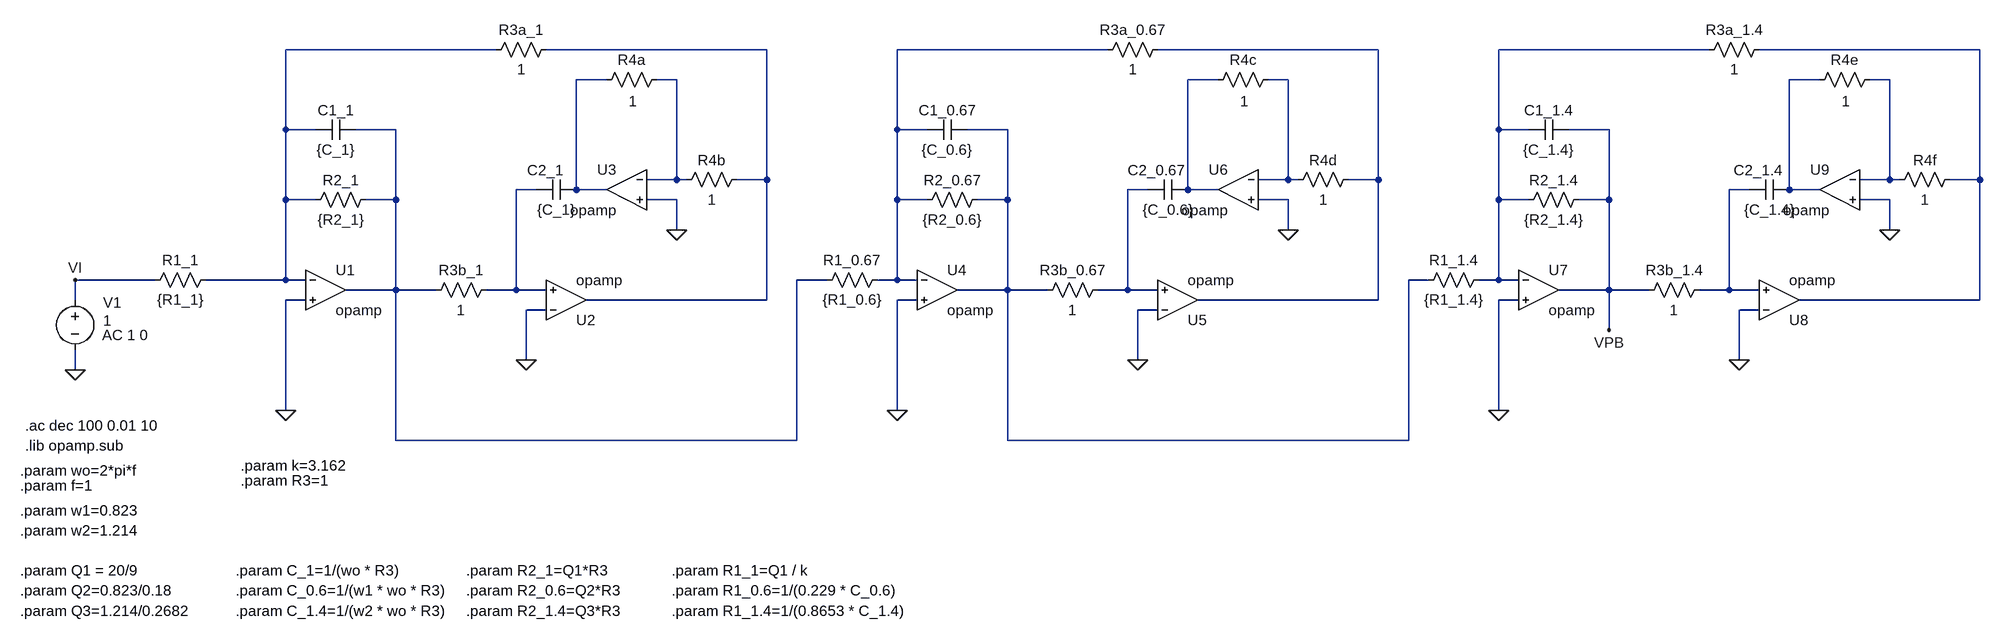
[diagram p0: schematic TransformacionLP2BP.asc]
TransformacionLP2BP.asc, the LTspice schematic file:
Version 4
SHEET 1 2392 1280
WIRE 16 -96 -320 -96
WIRE 448 -96 96 -96
WIRE 992 -96 656 -96
WIRE 1424 -96 1072 -96
WIRE 1952 -96 1616 -96
WIRE 2384 -96 2032 -96
WIRE 192 -48 144 -48
WIRE 304 -48 272 -48
WIRE 1168 -48 1120 -48
WIRE 1280 -48 1248 -48
WIRE 2128 -48 2080 -48
WIRE 2240 -48 2208 -48
WIRE -320 32 -320 -96
WIRE -272 32 -320 32
WIRE -144 32 -208 32
WIRE 656 32 656 -96
WIRE 704 32 656 32
WIRE 832 32 768 32
WIRE 1616 32 1616 -96
WIRE 1664 32 1616 32
WIRE 1792 32 1728 32
WIRE 304 112 304 -48
WIRE 304 112 256 112
WIRE 320 112 304 112
WIRE 448 112 448 -96
WIRE 448 112 400 112
WIRE 1280 112 1280 -48
WIRE 1280 112 1232 112
WIRE 1296 112 1280 112
WIRE 1424 112 1424 -96
WIRE 1424 112 1376 112
WIRE 2240 112 2240 -48
WIRE 2240 112 2192 112
WIRE 2256 112 2240 112
WIRE 2384 112 2384 -96
WIRE 2384 112 2336 112
WIRE 80 128 48 128
WIRE 144 128 144 -48
WIRE 192 128 144 128
WIRE 1056 128 1024 128
WIRE 1120 128 1120 -48
WIRE 1168 128 1120 128
WIRE 2016 128 1984 128
WIRE 2080 128 2080 -48
WIRE 2128 128 2080 128
WIRE -320 144 -320 32
WIRE -272 144 -320 144
WIRE -144 144 -144 32
WIRE -144 144 -192 144
WIRE 304 144 256 144
WIRE 656 144 656 32
WIRE 704 144 656 144
WIRE 832 144 832 32
WIRE 832 144 784 144
WIRE 1280 144 1232 144
WIRE 1616 144 1616 32
WIRE 1664 144 1616 144
WIRE 1792 144 1792 32
WIRE 1792 144 1744 144
WIRE 2240 144 2192 144
WIRE 304 192 304 144
WIRE 1280 192 1280 144
WIRE 2240 192 2240 144
WIRE -528 272 -656 272
WIRE -320 272 -320 144
WIRE -320 272 -448 272
WIRE -288 272 -320 272
WIRE 544 272 496 272
WIRE 656 272 656 144
WIRE 656 272 624 272
WIRE 688 272 656 272
WIRE 1504 272 1472 272
WIRE 1616 272 1616 144
WIRE 1616 272 1584 272
WIRE 1648 272 1616 272
WIRE -144 288 -144 144
WIRE -144 288 -224 288
WIRE -80 288 -144 288
WIRE 48 288 48 128
WIRE 48 288 0 288
WIRE 96 288 48 288
WIRE 832 288 832 144
WIRE 832 288 752 288
WIRE 896 288 832 288
WIRE 1024 288 1024 128
WIRE 1024 288 976 288
WIRE 1072 288 1024 288
WIRE 1792 288 1792 144
WIRE 1792 288 1712 288
WIRE 1856 288 1792 288
WIRE 1984 288 1984 128
WIRE 1984 288 1936 288
WIRE 2032 288 1984 288
WIRE -656 304 -656 272
WIRE -288 304 -320 304
WIRE 448 304 448 112
WIRE 448 304 160 304
WIRE 688 304 656 304
WIRE 1424 304 1424 112
WIRE 1424 304 1136 304
WIRE 1648 304 1616 304
WIRE 2384 304 2384 112
WIRE 2384 304 2096 304
WIRE 96 320 64 320
WIRE 1072 320 1040 320
WIRE 2032 320 2000 320
WIRE 1792 352 1792 288
WIRE 64 400 64 320
WIRE 1040 400 1040 320
WIRE 2000 400 2000 320
WIRE -656 416 -656 384
WIRE -320 480 -320 304
WIRE 656 480 656 304
WIRE 1616 480 1616 304
WIRE -144 528 -144 288
WIRE 496 528 496 272
WIRE 496 528 -144 528
WIRE 832 528 832 288
WIRE 1472 528 1472 272
WIRE 1472 528 832 528
FLAG -320 480 0
FLAG -656 416 0
FLAG 64 400 0
FLAG -656 272 VI
FLAG 304 192 0
FLAG 656 480 0
FLAG 1040 400 0
FLAG 1280 192 0
FLAG 1616 480 0
FLAG 2000 400 0
FLAG 2240 192 0
FLAG 1792 352 VPB
SYMBOL res -432 256 R90
WINDOW 0 0 56 VBottom 2
WINDOW 3 32 56 VTop 2
SYMATTR InstName R1_1
SYMATTR Value {R1_1}
SYMBOL res -176 128 R90
WINDOW 0 0 56 VBottom 2
WINDOW 3 32 56 VTop 2
SYMATTR InstName R2_1
SYMATTR Value {R2_1}
SYMBOL cap -208 16 R90
WINDOW 0 0 32 VBottom 2
WINDOW 3 32 32 VTop 2
SYMATTR InstName C1_1
SYMATTR Value {C_1}
SYMBOL voltage -656 288 R0
WINDOW 3 45 49 Left 2
WINDOW 123 43 72 Left 2
WINDOW 39 0 0 Left 0
WINDOW 0 45 20 Left 2
SYMATTR Value 1
SYMATTR Value2 AC 1 0
SYMATTR InstName V1
SYMBOL res 16 272 R90
WINDOW 0 0 56 VBottom 2
WINDOW 3 32 56 VTop 2
SYMATTR InstName R3b_1
SYMATTR Value 1
SYMBOL res 112 -112 R90
WINDOW 0 0 56 VBottom 2
WINDOW 3 32 56 VTop 2
SYMATTR InstName R3a_1
SYMATTR Value 1
SYMBOL cap 144 112 R90
WINDOW 0 0 50 VBottom 2
WINDOW 3 32 32 VTop 2
SYMATTR InstName C2_1
SYMATTR Value {C_1}
SYMBOL res 288 -64 R90
WINDOW 0 0 56 VBottom 2
WINDOW 3 35 54 VTop 2
SYMATTR InstName R4a
SYMATTR Value 1
SYMBOL res 416 96 R90
WINDOW 0 0 56 VBottom 2
WINDOW 3 32 56 VTop 2
SYMATTR InstName R4b
SYMATTR Value 1
SYMBOL OpAmps\\opamp -256 224 R0
SYMATTR InstName U1
SYMBOL OpAmps\\opamp 128 368 M180
SYMATTR InstName U2
SYMBOL OpAmps\\opamp 224 64 M0
SYMATTR InstName U3
SYMBOL res 800 128 R90
WINDOW 0 0 56 VBottom 2
WINDOW 3 32 56 VTop 2
SYMATTR InstName R2_0.67
SYMATTR Value {R2_0.6}
SYMBOL cap 768 16 R90
WINDOW 0 0 32 VBottom 2
WINDOW 3 32 32 VTop 2
SYMATTR InstName C1_0.67
SYMATTR Value {C_0.6}
SYMBOL res 992 272 R90
WINDOW 0 0 56 VBottom 2
WINDOW 3 32 56 VTop 2
SYMATTR InstName R3b_0.67
SYMATTR Value 1
SYMBOL res 1088 -112 R90
WINDOW 0 0 56 VBottom 2
WINDOW 3 32 56 VTop 2
SYMATTR InstName R3a_0.67
SYMATTR Value 1
SYMBOL cap 1120 112 R90
WINDOW 0 0 50 VBottom 2
WINDOW 3 32 32 VTop 2
SYMATTR InstName C2_0.67
SYMATTR Value {C_0.6}
SYMBOL res 1264 -64 R90
WINDOW 0 0 56 VBottom 2
WINDOW 3 35 54 VTop 2
SYMATTR InstName R4c
SYMATTR Value 1
SYMBOL res 1392 96 R90
WINDOW 0 0 56 VBottom 2
WINDOW 3 32 56 VTop 2
SYMATTR InstName R4d
SYMATTR Value 1
SYMBOL OpAmps\\opamp 720 224 R0
SYMATTR InstName U4
SYMBOL OpAmps\\opamp 1104 368 M180
SYMATTR InstName U5
SYMBOL OpAmps\\opamp 1200 64 M0
SYMATTR InstName U6
SYMBOL res 1760 128 R90
WINDOW 0 0 56 VBottom 2
WINDOW 3 32 56 VTop 2
SYMATTR InstName R2_1.4
SYMATTR Value {R2_1.4}
SYMBOL cap 1728 16 R90
WINDOW 0 0 32 VBottom 2
WINDOW 3 32 32 VTop 2
SYMATTR InstName C1_1.4
SYMATTR Value {C_1.4}
SYMBOL res 1952 272 R90
WINDOW 0 0 56 VBottom 2
WINDOW 3 32 56 VTop 2
SYMATTR InstName R3b_1.4
SYMATTR Value 1
SYMBOL res 2048 -112 R90
WINDOW 0 0 56 VBottom 2
WINDOW 3 32 56 VTop 2
SYMATTR InstName R3a_1.4
SYMATTR Value 1
SYMBOL cap 2080 112 R90
WINDOW 0 0 50 VBottom 2
WINDOW 3 32 32 VTop 2
SYMATTR InstName C2_1.4
SYMATTR Value {C_1.4}
SYMBOL res 2224 -64 R90
WINDOW 0 0 56 VBottom 2
WINDOW 3 35 54 VTop 2
SYMATTR InstName R4e
SYMATTR Value 1
SYMBOL res 2352 96 R90
WINDOW 0 0 56 VBottom 2
WINDOW 3 32 56 VTop 2
SYMATTR InstName R4f
SYMATTR Value 1
SYMBOL OpAmps\\opamp 1680 224 R0
SYMATTR InstName U7
SYMBOL OpAmps\\opamp 2064 368 M180
SYMATTR InstName U8
SYMBOL OpAmps\\opamp 2160 64 M0
SYMATTR InstName U9
SYMBOL res 640 256 R90
WINDOW 0 0 56 VBottom 2
WINDOW 3 32 56 VTop 2
SYMATTR InstName R1_0.67
SYMATTR Value {R1_0.6}
SYMBOL res 1600 256 R90
WINDOW 0 0 56 VBottom 2
WINDOW 3 32 56 VTop 2
SYMATTR InstName R1_1.4
SYMATTR Value {R1_1.4}
TEXT -736 504 Left 2 !.ac dec 100 0.01 10
TEXT -736 536 Left 2 !.lib opamp.sub
TEXT -400 736 Left 2 !.param C_1=1/(wo * R3)
TEXT -744 576 Left 2 !.param wo=2*pi*f
TEXT -744 600 Left 2 !.param f=1
TEXT -400 768 Left 2 !.param C_0.6=1/(w1 * wo * R3)
TEXT -400 800 Left 2 !.param C_1.4=1/(w2 * wo * R3)
TEXT -744 736 Left 2 !.param Q1 = 20/9
TEXT -744 768 Left 2 !.param Q2=0.823/0.18
TEXT -744 800 Left 2 !.param Q3=1.214/0.2682
TEXT -32 736 Left 2 !.param R2_1=Q1*R3
TEXT -32 768 Left 2 !.param R2_0.6=Q2*R3
TEXT -32 800 Left 2 !.param R2_1.4=Q3*R3
TEXT 296 736 Left 2 !.param R1_1=Q1 / k
TEXT 296 768 Left 2 !.param R1_0.6=1/(0.229 * C_0.6)
TEXT 296 800 Left 2 !.param R1_1.4=1/(0.8653 * C_1.4)
TEXT -744 640 Left 2 !.param w1=0.823
TEXT -744 672 Left 2 !.param w2=1.214
TEXT -392 568 Left 2 !.param k=3.162
TEXT -392 592 Left 2 !.param R3=1

The netlist it stands for:
* TransformacionLP2BP.asc
R1_1 N001 VI {R1_1}
R2_1 N013 N001 {R2_1}
C1_1 N013 N001 {C_1}
V1 VI 0 1 AC 1 0
R3b_1 N015 N013 1
R3a_1 N002 N001 1
C2_1 N007 N015 {C_1}
R4a N008 N007 1
R4b N002 N008 1
XU1 N001 0 N013 opamp Aol=100K GBW=10Meg  ; pins invin noninvin out
XU2 0 N015 N002 opamp Aol=100K GBW=10Meg  ; pins invin noninvin out
XU3 N008 0 N007 opamp Aol=100K GBW=10Meg  ; pins invin noninvin out
R2_0.67 N014 N003 {R2_0.6}
C1_0.67 N014 N003 {C_0.6}
R3b_0.67 N016 N014 1
R3a_0.67 N004 N003 1
C2_0.67 N009 N016 {C_0.6}
R4c N010 N009 1
R4d N004 N010 1
XU4 N003 0 N014 opamp Aol=100K GBW=10Meg  ; pins invin noninvin out
XU5 0 N016 N004 opamp Aol=100K GBW=10Meg  ; pins invin noninvin out
XU6 N010 0 N009 opamp Aol=100K GBW=10Meg  ; pins invin noninvin out
R2_1.4 VPB N005 {R2_1.4}
C1_1.4 VPB N005 {C_1.4}
R3b_1.4 N017 VPB 1
R3a_1.4 N006 N005 1
C2_1.4 N011 N017 {C_1.4}
R4e N012 N011 1
R4f N006 N012 1
XU7 N005 0 VPB opamp Aol=100K GBW=10Meg  ; pins invin noninvin out
XU8 0 N017 N006 opamp Aol=100K GBW=10Meg  ; pins invin noninvin out
XU9 N012 0 N011 opamp Aol=100K GBW=10Meg  ; pins invin noninvin out
R1_0.67 N003 N013 {R1_0.6}
R1_1.4 N005 N014 {R1_1.4}
.ac dec 100 0.01 10
.lib opamp.sub
.param C_1=1/(wo * R3)
.param wo=2*pi*f
.param f=1
.param C_0.6=1/(w1 * wo * R3)
.param C_1.4=1/(w2 * wo * R3)
.param Q1 = 20/9
.param Q2=0.823/0.18
.param Q3=1.214/0.2682
.param R2_1=Q1*R3
.param R2_0.6=Q2*R3
.param R2_1.4=Q3*R3
.param R1_1=Q1 / k
.param R1_0.6=1/(0.229 * C_0.6)
.param R1_1.4=1/(0.8653 * C_1.4)
.param w1=0.823
.param w2=1.214
.param k=3.162
.param R3=1
.backanno
.end